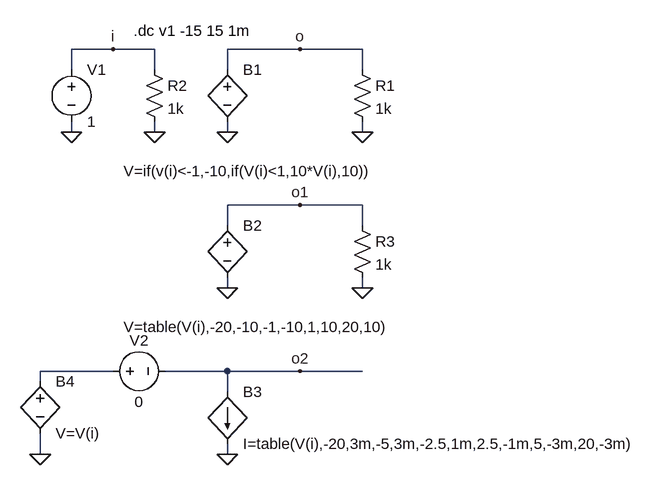
[diagram p0: schematic Behavioral3.asc]
Behavioral3.asc, the LTspice schematic file:
Version 4
SHEET 1 892 796
WIRE 16 96 -48 96
WIRE 80 96 16 96
WIRE 304 96 192 96
WIRE 400 96 304 96
WIRE -48 128 -48 96
WIRE 80 128 80 96
WIRE 192 128 192 96
WIRE 400 128 400 96
WIRE -48 224 -48 208
WIRE 80 224 80 208
WIRE 192 224 192 208
WIRE 400 224 400 208
WIRE 304 336 192 336
WIRE 400 336 304 336
WIRE 192 368 192 336
WIRE 400 368 400 336
WIRE 192 464 192 448
WIRE 400 464 400 448
WIRE 16 592 -96 592
WIRE 192 592 96 592
WIRE 304 592 192 592
WIRE 400 592 304 592
WIRE -96 608 -96 592
WIRE 192 624 192 592
WIRE -96 720 -96 688
WIRE 192 720 192 704
FLAG 192 224 0
FLAG 400 224 0
FLAG 80 224 0
FLAG -48 224 0
FLAG 16 96 i
FLAG 304 96 o
FLAG 192 464 0
FLAG 400 464 0
FLAG 304 336 o1
FLAG 192 720 0
FLAG 304 592 o2
FLAG -96 720 0
SYMBOL bv 192 112 R0
WINDOW 3 -160 172 Left 2
SYMATTR InstName B1
SYMATTR Value V=if(v(i)<-1,-10,if(V(i)<1,10*V(i),10))
SYMBOL res 384 112 R0
SYMATTR InstName R1
SYMATTR Value 1k
SYMBOL res 64 112 R0
SYMATTR InstName R2
SYMATTR Value 1k
SYMBOL voltage -48 112 R0
WINDOW 123 0 0 Left 0
WINDOW 39 0 0 Left 0
SYMATTR InstName V1
SYMATTR Value 1
SYMBOL bv 192 352 R0
WINDOW 3 -160 172 Left 2
SYMATTR InstName B2
SYMATTR Value V=table(V(i),-20,-10,-1,-10,1,10,20,10)
SYMBOL res 384 352 R0
SYMATTR InstName R3
SYMATTR Value 1k
SYMBOL bi 192 624 R0
SYMATTR InstName B3
SYMATTR Value I=table(V(i),-20,3m,-5,3m,-2.5,1m,2.5,-1m,5,-3m,20,-3m)
SYMBOL bv -96 592 R0
SYMATTR InstName B4
SYMATTR Value V=V(i)
SYMBOL voltage 0 592 R270
WINDOW 0 32 56 VTop 2
WINDOW 3 -32 56 VBottom 2
WINDOW 123 0 0 Left 0
WINDOW 39 0 0 Left 0
SYMATTR InstName V2
SYMATTR Value 0
TEXT 48 68 Left 2 !.dc v1 -15 15 1m

The netlist it stands for:
* Behavioral3.asc
B1 o 0 V=if(v(i)<-1,-10,if(V(i)<1,10*V(i),10))
R1 o 0 1k
R2 i 0 1k
V1 i 0 1
B2 o1 0 V=table(V(i),-20,-10,-1,-10,1,10,20,10)
R3 o1 0 1k
B3 o2 0 I=table(V(i),-20,3m,-5,3m,-2.5,1m,2.5,-1m,5,-3m,20,-3m)
B4 N001 0 V=V(i)
V2 N001 o2 0
.dc v1 -15 15 1m
.backanno
.end